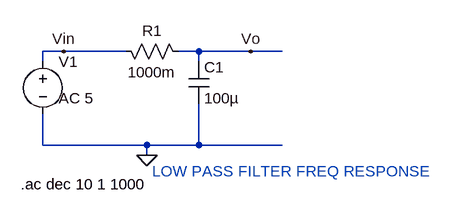
[diagram p0: schematic LOW PASS FILTER FREQ RESPONSE.asc]
LOW PASS FILTER FREQ RESPONSE.asc, the LTspice schematic file:
Version 4
SHEET 1 880 680
WIRE 0 128 -32 128
WIRE 96 128 0 128
WIRE 208 128 176 128
WIRE 288 128 208 128
WIRE 336 128 288 128
WIRE -32 144 -32 128
WIRE 208 144 208 128
WIRE -32 272 -32 224
WIRE 128 272 -32 272
WIRE 208 272 208 208
WIRE 208 272 128 272
WIRE 336 272 208 272
WIRE 128 288 128 272
FLAG 128 288 0
FLAG 288 128 Vo
FLAG 0 128 Vin
SYMBOL res 192 144 M270
WINDOW 0 32 56 VTop 2
WINDOW 3 0 56 VBottom 2
SYMATTR InstName R1
SYMATTR Value 1000m
SYMBOL cap 192 144 R0
SYMATTR InstName C1
SYMATTR Value 100µ
SYMBOL voltage -32 128 R0
WINDOW 3 -283 110 Left 2
WINDOW 123 24 72 Left 2
WINDOW 39 0 0 Left 2
SYMATTR Value ""
SYMATTR Value2 AC 5
SYMATTR InstName V1
TEXT 136 312 Left 2 ;LOW PASS FILTER FREQ RESPONSE
TEXT -66 332 Left 2 !.ac dec 10 1 1000

The netlist it stands for:
* LOW PASS FILTER FREQ RESPONSE.asc
R1 Vo Vin 1000m
C1 Vo 0 100µ
V1 Vin 0 AC 5
* LOW PASS FILTER FREQ RESPONSE
.ac dec 10 1 1000
.backanno
.end

* Results of the author's LTspice run, read from the files saved beside the schematic
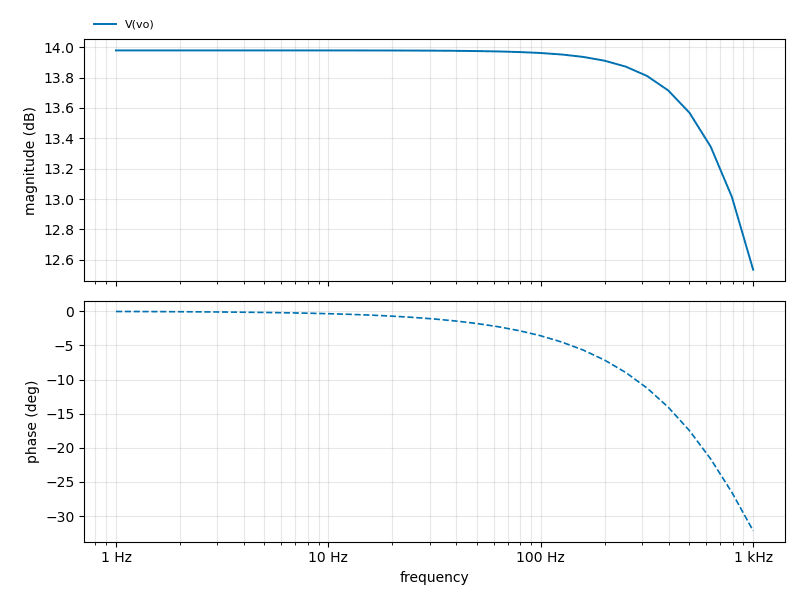
[diagram p1: AC Analysis of LOW PASS FILTER FREQ RESPONSE.asc, plotted from the saved traces]
* AC Analysis, 1 run:
*   V(vo): 13.98 dB at 1 Hz, 12.53 dB at 1 kHz, peak 13.98 dB at 1 Hz